# EAGLE schematic M_C_ext_main (EAGLE 9.6.2)
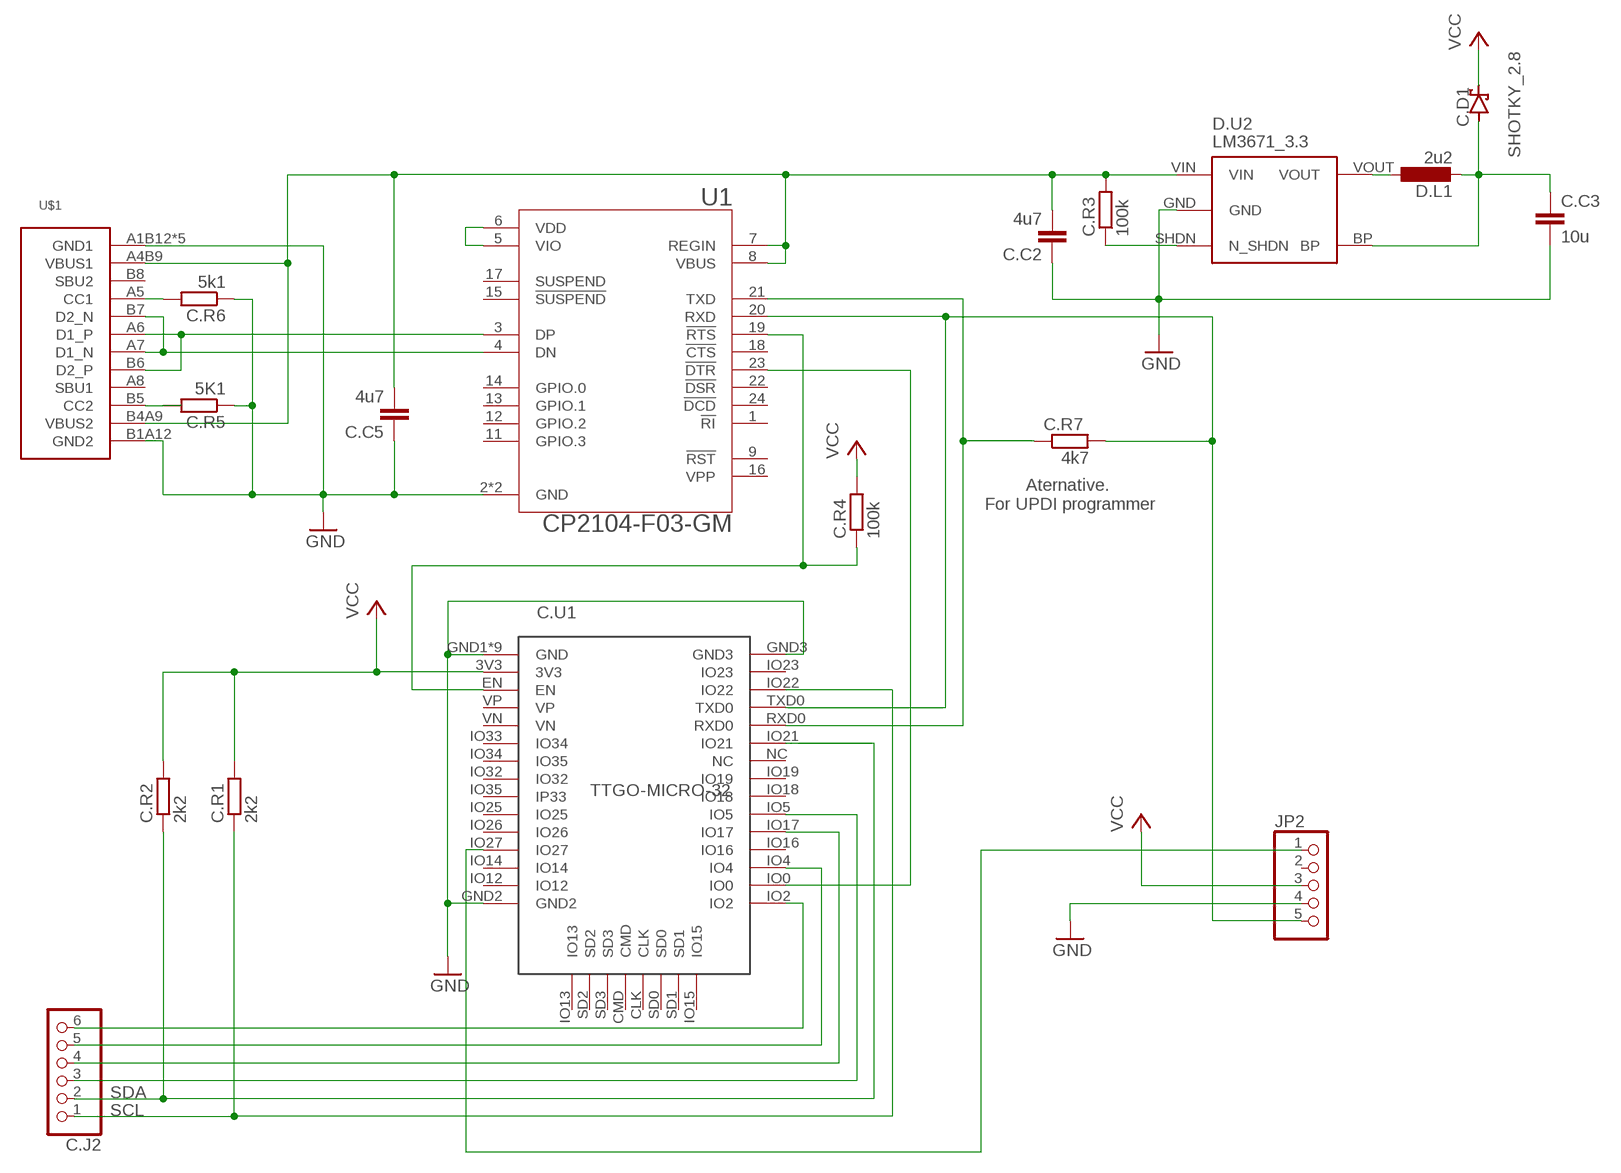
[diagram p0: schematic, sheet 1]

## Parts
C.C2  4u7  C-EUC0603  [C0603]
C.C3  10u  C-EUC0805  [C0805]
C.C5  4u7  C-EUC0603  [C0603]
C.D1  SHOTKY_2.8  [SHOTKY_2.8]
C.J2  PINHD-1X6  [1X06]
C.R1  2k2  R-EU_R0603  [R0603]
C.R2  2k2  R-EU_R0603  [R0603]
C.R3  100k  R-EU_R0603  [R0603]
C.R4  100k  R-EU_R0603  [R0603]
C.R5  5K1  R-EU_R0603  [R0603]
C.R6  5k1  R-EU_R0603  [R0603]
C.R7  4k7  R-EU_R0603  [R0603]
C.U1  TTGO-MICRO-32  [TTGO-MICRO-32]
D.L1  2u2  L-EUL3230M  [L3230M]
D.U2  LM3671_3.3  STABILISER_APE8865  [SOT32-5]
JP2  PINHD-1X5  [1X05]
U1  CP2104-F03-GM  [QFN50P400X400X80-25N]
U$1  USB-C  [USB-C]

## Nets
GND: C.C2.1 C.C3.2 C.C5.1 C.R5.1 C.R6.1 C.U1.GND1(GND) C.U1.GND2 C.U1.GND3 C.U1.GND4(GND) C.U1.GND5(GND) C.U1.GND6(GND) C.U1.GND7(GND) C.U1.GND8(GND) C.U1.GND9(GND) C.U1.GND10(GND) C.U1.GND11(GND) D.U2.GND JP2.4 U1.2(GND) U1.25(GND) U$1.A1B12(GND1) U$1.B1A12(GND2) U$1.SH1(GND1) U$1.SH2(GND1) U$1.SH3(GND1) U$1.SH4(GND1)
N$1: U1.4(DN) U$1.A7(D1_N) U$1.B7(D2_N)
N$2: U1.3(DP) U$1.A6(D1_P) U$1.B6(D2_P)
N$3: C.R6.2 U$1.A5(CC1)
N$4: C.R5.2 U$1.B5(CC2)
N$5: C.C3.1 C.D1.A D.L1.2 D.U2.BP
N$6: C.J2.6 C.U1.IO2
N$8: U1.5(VIO) U1.6(VDD)
N$10: D.L1.1 D.U2.VOUT
N$11: C.R3.1 D.U2.SHDN(N_SHDN)
N$12: C.J2.5 C.U1.IO4
N$13: C.J2.4 C.U1.IO17
N$14: C.J2.3 C.U1.IO5
N$15: C.U1.IO27 JP2.1
PROG: C.U1.IO0 U1.23(!DTR)
RESET: C.R4.1 C.U1.EN U1.19(!RTS)
RX: C.R7.2 C.U1.TXD0 JP2.5 U1.20(RXD)
SCL: C.J2.1 C.R1.1 C.U1.IO22
SDA: C.J2.2 C.R2.1 C.U1.IO21
TX: C.R7.1 C.U1.RXD0 U1.21(TXD)
VCC: C.D1.K(C) C.R1.2 C.R2.2 C.R4.2 C.U1.3V3 JP2.3
VUSB: C.C2.2 C.C5.2 C.R3.2 D.U2.VIN U1.7(REGIN) U1.8(VBUS) U$1.A4B9(VBUS1) U$1.B4A9(VBUS2)
Unconnected: C.U1.CLK C.U1.CMD C.U1.IO12 C.U1.IO13 C.U1.IO14 C.U1.IO15 C.U1.IO16 C.U1.IO18 C.U1.IO19 C.U1.IO23 C.U1.IO25 C.U1.IO26 C.U1.IO32 C.U1.IO33(IO34) C.U1.IO34(IO35) C.U1.IO35(IP33) C.U1.NC C.U1.SD0 C.U1.SD1 C.U1.SD2 C.U1.SD3 C.U1.VN C.U1.VP JP2.2 U1.1(!RI) U1.9(!RST!) U1.11(GPIO.3) U1.12(GPIO.2) U1.13(GPIO.1) U1.14(GPIO.0) U1.15(!SUSPEND!) U1.16(VPP) U1.17(SUSPEND) U1.18(!CTS) U1.22(!DSR) U1.24(!DCD) U$1.A8(SBU1) U$1.B8(SBU2)

## Notes on the sheet
- Aternative. 
  For UPDI programmer

## Library data of the parts
C.C2 C.C3 C.C5 = rcl:C-EU: CAPACITOR, European symbol; SPICEPREFIX: C
C.D1 = hugo:SHOTKY_2.8
C.J2 = pinhead2:PINHD-1X6: PIN HEADER
C.R1-C.R7 = rcl:R-EU_: RESISTOR, European symbol; SPICEPREFIX: R
C.U1 = hugo:TTGO-MICRO-32
D.L1 = rcl:L-EU: INDUCTOR, European symbol; SPICEPREFIX: L
D.U2 = !stavebnice03:STABILISER_APE8865
JP2 = pinhead2:PINHD-1X5: PIN HEADER
U1 = CP2104:CP2104: Silabs CP2104 USB to UART Bridge; AVAILABILITY: Unavailable; DESCRIPTION: USB Bridge, USB to UART USB 2.0 UART Interface 24-QFN (4x4); MF: Silicon Labs; MP: CP2104; PACKAGE: QFN-24 Silicon Labs; PRICE: None
U$1 = hugo:USB-C